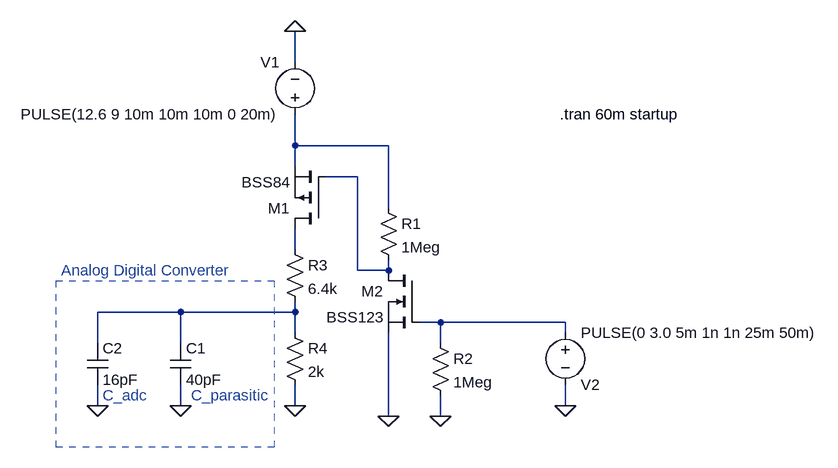
[diagram p0: schematic Voltage_sense.asc]
Voltage_sense.asc, the LTspice schematic file:
Version 4
SHEET 1 912 680
WIRE 48 -128 48 -176
WIRE 48 0 48 -48
WIRE 192 0 48 0
WIRE 48 32 48 0
WIRE 144 48 96 48
WIRE 192 96 192 0
WIRE 48 160 48 128
WIRE 144 192 144 48
WIRE 192 192 192 176
WIRE 192 192 144 192
WIRE -128 256 -256 256
WIRE 48 256 48 240
WIRE 48 256 -128 256
WIRE 272 272 240 272
WIRE 464 272 272 272
WIRE 48 288 48 256
WIRE 464 288 464 272
WIRE -256 304 -256 256
WIRE -128 304 -128 256
WIRE 272 304 272 272
WIRE -256 400 -256 368
WIRE -128 400 -128 368
WIRE 48 400 48 368
WIRE 464 400 464 368
WIRE 192 416 192 288
WIRE 272 416 272 384
FLAG 192 416 0
FLAG 48 400 0
FLAG 48 -176 0
FLAG 464 400 0
FLAG 272 416 0
FLAG -256 400 0
FLAG -128 400 0
SYMBOL pmos 96 128 R180
SYMATTR InstName M1
SYMATTR Value BSS84
SYMBOL nmos 240 192 M0
SYMATTR InstName M2
SYMATTR Value BSS123
SYMBOL res 176 80 R0
SYMATTR InstName R1
SYMATTR Value 1Meg
SYMBOL res 32 144 R0
SYMATTR InstName R3
SYMATTR Value 6.4k
SYMBOL res 32 272 R0
SYMATTR InstName R4
SYMATTR Value 2k
SYMBOL voltage 48 -32 R180
WINDOW 0 24 96 Left 2
WINDOW 3 24 16 Left 2
WINDOW 123 0 0 Left 0
WINDOW 39 0 0 Left 0
SYMATTR InstName V1
SYMATTR Value PULSE(12.6 9 10m 10m 10m 0 20m)
SYMBOL voltage 464 272 R0
WINDOW 0 24 96 Left 2
WINDOW 3 24 16 Left 2
WINDOW 123 0 0 Left 0
WINDOW 39 0 0 Left 0
SYMATTR InstName V2
SYMATTR Value PULSE(0 3.0 5m 1n 1n 25m 50m)
SYMBOL res 256 288 R0
SYMATTR InstName R2
SYMATTR Value 1Meg
SYMBOL cap -272 304 R0
SYMATTR InstName C2
SYMATTR Value 16pF
SYMBOL cap -144 304 R0
SYMATTR InstName C1
SYMATTR Value 40pF
TEXT 456 -48 Left 2 !.tran 60m startup
TEXT -112 384 Left 2 ;C_parasitic
TEXT -248 384 Left 2 ;C_adc
TEXT -312 192 Left 2 ;Analog Digital Converter
RECTANGLE Normal 16 464 -320 208 2

The netlist it stands for:
* Voltage_sense.asc
M1 N003 N002 N001 N001 BSS84
M2 N002 N005 0 0 BSS123
R1 N001 N002 1Meg
R3 N003 N004 6.4k
R4 N004 0 2k
V1 N001 0 PULSE(12.6 9 10m 10m 10m 0 20m)
V2 N005 0 PULSE(0 3.0 5m 1n 1n 25m 50m)
R2 N005 0 1Meg
C2 N004 0 16pF
C1 N004 0 40pF
.model NMOS NMOS
.model PMOS PMOS
.lib standard.mos
.tran 60m startup
* C_parasitic
* C_adc
* Analog Digital Converter
.backanno
.end